# EAGLE schematic unoedge_v41 (EAGLE 7.3.0)
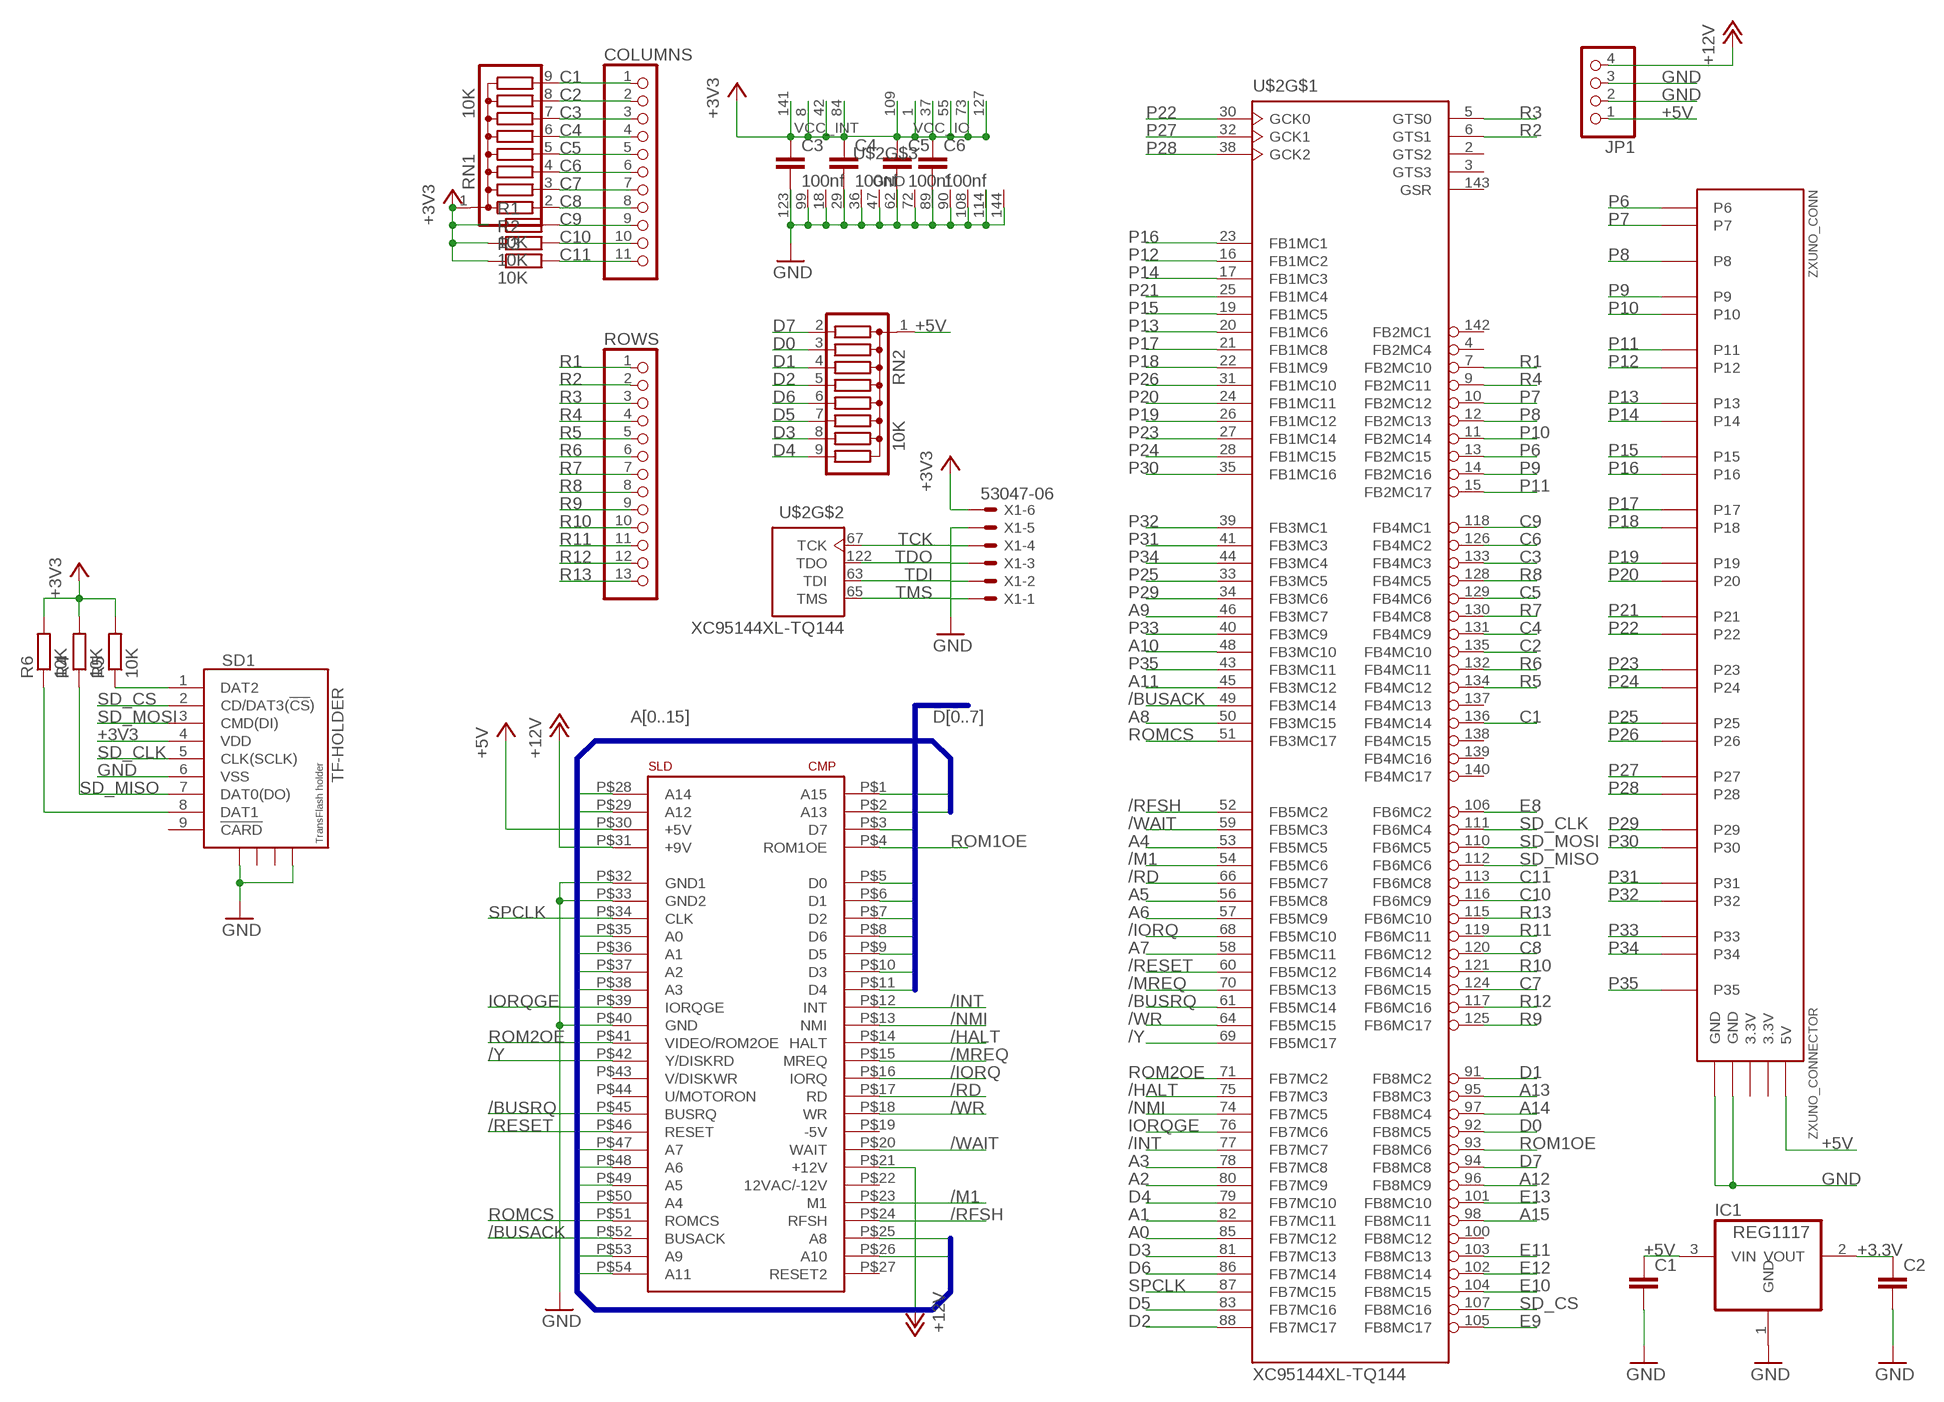
[diagram p0: schematic, sheet 1]

## Parts
C1  C-EUC0805  [C0805]
C2  C-EUC0805  [C0805]
C3  100nf  C-EUC0603  [C0603]
C4  100nf  C-EUC0603  [C0603]
C5  100nf  C-EUC0603  [C0603]
C6  100nf  C-EUC0603  [C0603]
COLUMNS  PINHD-1X11  [1X11]
IC1  REG1117  [SOT223]
JP1  PINHD-1X4  [1X04]
R1  10K  R-EU_R0603  [R0603]
R2  10K  R-EU_R0603  [R0603]
R3  10K  R-EU_R0603  [R0603]
R4  10K  R-EU_R0603  [R0603]
R5  10K  R-EU_R0603  [R0603]
R6  10K  R-EU_R0603  [R0603]
RN1  10K  G08R  [SIL9]
RN2  10K  G08R  [SIL9]
ROWS  PINHD-1X13  [1X13]
SD1  TF-HOLDER  [TF-PULL]
U$1  CONECTOR_EDGE_LADO_SPECTRUM  [CONECTOR_LADO_SPECTRUM]
U$2  XC95144XL-TQ144  [TQ144]
X1  53047-06  [53047-06]
ZXUNO_CONN  ZXUNO_CONNECTOR  [ZXUNO_CONNECTOR]

## Nets
+3.3V: C2.1 IC1.2(VOUT)
+3V3 [power]: C3.1 C4.1 C5.1 C6.1 R1.1 R2.1 R3.1 R4.2 R5.2 R6.2 RN1.1 SD1.4(VDD) U$2.1(VCC_IO) U$2.8(VCC_INT) U$2.37(VCC_IO) U$2.42(VCC_INT) U$2.55(VCC_IO) U$2.73(VCC_IO) U$2.84(VCC_INT) U$2.109(VCC_IO) U$2.127(VCC_IO) U$2.141(VCC_INT) X1.1
+5V [power]: C1.1 IC1.3(VIN) JP1.1 RN2.1 U$1.P$30(+5V) ZXUNO_CONN.5V
+12V [power]: JP1.4 U$1.P$21(+12V) U$1.P$31(+9V)
/BUSACK: U$1.P$52(BUSACK) U$2.49(FB3MC14)
/BUSRQ: U$1.P$45(BUSRQ) U$2.61(FB5MC14)
/HALT [power]: U$1.P$14(HALT) U$2.75(FB7MC3)
/INT: U$1.P$12(INT) U$2.77(FB7MC7)
/IORQ: U$1.P$16(IORQ) U$2.68(FB5MC10)
/M1: U$1.P$23(M1) U$2.54(FB5MC6)
/MREQ: U$1.P$15(MREQ) U$2.70(FB5MC13)
/NMI: U$1.P$13(NMI) U$2.74(FB7MC5)
/RD: U$1.P$17(RD) U$2.66(FB5MC7)
/RESET: U$1.P$46(RESET) U$2.60(FB5MC12)
/RFSH [power]: U$1.P$24(RFSH) U$2.52(FB5MC2)
/WAIT: U$1.P$20(WAIT) U$2.59(FB5MC3)
/WR: U$1.P$18(WR) U$2.64(FB5MC15)
/Y: U$1.P$42(Y/DISKRD) U$2.69(FB5MC17)
A0: U$1.P$35(A0) U$2.85(FB7MC12)
A1: U$1.P$36(A1) U$2.82(FB7MC11)
A2: U$1.P$37(A2) U$2.80(FB7MC9)
A3: U$1.P$38(A3) U$2.78(FB7MC8)
A4: U$1.P$50(A4) U$2.53(FB5MC5)
A5: U$1.P$49(A5) U$2.56(FB5MC8)
A6: U$1.P$48(A6) U$2.57(FB5MC9)
A7: U$1.P$47(A7) U$2.58(FB5MC11)
A8: U$1.P$25(A8) U$2.50(FB3MC15)
A9: U$1.P$53(A9) U$2.46(FB3MC7)
A10: U$1.P$26(A10) U$2.48(FB3MC10)
A11: U$1.P$54(A11) U$2.45(FB3MC12)
A12: U$1.P$29(A12) U$2.96(FB8MC9)
A13: U$1.P$2(A13) U$2.95(FB8MC3)
A14: U$1.P$28(A14) U$2.97(FB8MC4)
A15: U$1.P$1(A15) U$2.98(FB8MC11)
C1: COLUMNS.1 RN1.9 U$2.136(FB4MC14)
C2: COLUMNS.2 RN1.8 U$2.135(FB4MC10)
C3: COLUMNS.3 RN1.7 U$2.133(FB4MC3)
C4: COLUMNS.4 RN1.6 U$2.131(FB4MC9)
C5: COLUMNS.5 RN1.5 U$2.129(FB4MC6)
C6: COLUMNS.6 RN1.4 U$2.126(FB4MC2)
C7: COLUMNS.7 RN1.3 U$2.124(FB6MC15)
C8: COLUMNS.8 RN1.2 U$2.120(FB6MC12)
C9: COLUMNS.9 R1.2 U$2.118(FB4MC1)
C10: COLUMNS.10 R2.2 U$2.116(FB6MC9)
C11: COLUMNS.11 R3.2 U$2.113(FB6MC8)
D0: RN2.3 U$1.P$5(D0) U$2.92(FB8MC5)
D1: RN2.4 U$1.P$6(D1) U$2.91(FB8MC2)
D2: RN2.5 U$1.P$7(D2) U$2.88(FB7MC17)
D3: RN2.8 U$1.P$10(D3) U$2.81(FB7MC13)
D4: RN2.9 U$1.P$11(D4) U$2.79(FB7MC10)
D5: RN2.7 U$1.P$9(D5) U$2.83(FB7MC16)
D6: RN2.6 U$1.P$8(D6) U$2.86(FB7MC14)
D7: RN2.2 U$1.P$3(D7) U$2.94(FB8MC8)
E8: U$2.106(FB6MC2)
E9: U$2.105(FB8MC17)
E10: U$2.104(FB8MC15)
E11: U$2.103(FB8MC13)
E12: U$2.102(FB8MC14)
E13: U$2.101(FB8MC10)
GND [power]: C1.2 C2.2 C3.2 C4.2 C5.2 C6.2 IC1.1(GND) JP1.2 JP1.3 SD1.6(VSS) SD1.S1 SD1.S4 U$1.P$32(GND1) U$1.P$33(GND2) U$1.P$40(GND) U$2.18(GND) U$2.29(GND) U$2.36(GND) U$2.47(GND) U$2.62(GND) U$2.72(GND) U$2.89(GND) U$2.90(GND) U$2.99(GND) U$2.108(GND) U$2.114(GND) U$2.123(GND) U$2.144(GND) X1.2 ZXUNO_CONN.GND@1(GND) ZXUNO_CONN.GND@2(GND)
IORQGE: U$1.P$39(IORQGE) U$2.76(FB7MC6)
N$2: R6.1 SD1.8(DAT1)
N$3: R5.1 SD1.1(DAT2)
P6: U$2.13(FB2MC15) ZXUNO_CONN.P6
P7: U$2.10(FB2MC12) ZXUNO_CONN.P7
P8: U$2.12(FB2MC13) ZXUNO_CONN.P8
P9: U$2.14(FB2MC16) ZXUNO_CONN.P9
P10: U$2.11(FB2MC14) ZXUNO_CONN.P10
P11: U$2.15(FB2MC17) ZXUNO_CONN.P11
P12: U$2.16(FB1MC2) ZXUNO_CONN.P12
P13: U$2.20(FB1MC6) ZXUNO_CONN.P13
P14: U$2.17(FB1MC3) ZXUNO_CONN.P14
P15: U$2.19(FB1MC5) ZXUNO_CONN.P15
P16: U$2.23(FB1MC1) ZXUNO_CONN.P16
P17: U$2.21(FB1MC8) ZXUNO_CONN.P17
P18: U$2.22(FB1MC9) ZXUNO_CONN.P18
P19: U$2.26(FB1MC12) ZXUNO_CONN.P19
P20: U$2.24(FB1MC11) ZXUNO_CONN.P20
P21: U$2.25(FB1MC4) ZXUNO_CONN.P21
P22: U$2.30(GCK0) ZXUNO_CONN.P22
P23: U$2.27(FB1MC14) ZXUNO_CONN.P23
P24: U$2.28(FB1MC15) ZXUNO_CONN.P24
P25: U$2.33(FB3MC5) ZXUNO_CONN.P25
P26: U$2.31(FB1MC10) ZXUNO_CONN.P26
P27: U$2.32(GCK1) ZXUNO_CONN.P27
P28: U$2.38(GCK2) ZXUNO_CONN.P28
P29: U$2.34(FB3MC6) ZXUNO_CONN.P29
P30: U$2.35(FB1MC16) ZXUNO_CONN.P30
P31: U$2.41(FB3MC3) ZXUNO_CONN.P31
P32: U$2.39(FB3MC1) ZXUNO_CONN.P32
P33: U$2.40(FB3MC9) ZXUNO_CONN.P33
P34: U$2.44(FB3MC4) ZXUNO_CONN.P34
P35: U$2.43(FB3MC11) ZXUNO_CONN.P35
R1: ROWS.1 U$2.7(FB2MC10)
R2: ROWS.2 U$2.6(GTS1)
R3: ROWS.3 U$2.5(GTS0)
R4: ROWS.4 U$2.9(FB2MC11)
R5: ROWS.5 U$2.134(FB4MC12)
R6: ROWS.6 U$2.132(FB4MC11)
R7: ROWS.7 U$2.130(FB4MC8)
R8: ROWS.8 U$2.128(FB4MC5)
R9: ROWS.9 U$2.125(FB6MC17)
R10: ROWS.10 U$2.121(FB6MC14)
R11: ROWS.11 U$2.119(FB6MC11)
R12: ROWS.12 U$2.117(FB6MC16)
R13: ROWS.13 U$2.115(FB6MC10)
ROM1OE: U$1.P$4(ROM1OE) U$2.93(FB8MC6)
ROM2OE: U$1.P$41(VIDEO/ROM2OE) U$2.71(FB7MC2)
ROMCS: U$1.P$51(ROMCS) U$2.51(FB3MC17)
SD_CLK: SD1.5(CLK(SCLK)) U$2.111(FB6MC4)
SD_CS: SD1.2(CD/DAT3(!CS!)) U$2.107(FB8MC16)
SD_MISO: R4.1 SD1.7(DAT0(DO)) U$2.112(FB6MC6)
SD_MOSI: SD1.3(CMD(DI)) U$2.110(FB6MC5)
SPCLK: U$1.P$34(CLK) U$2.87(FB7MC15)
TCK: U$2.67(TCK) X1.3
TDI: U$2.63(TDI) X1.5
TDO: U$2.122(TDO) X1.4
TMS: U$2.65(TMS) X1.6
Unconnected: SD1.9(!CARD) SD1.S2 SD1.S3 U$1.P$19(-5V) U$1.P$22(12VAC/-12V) U$1.P$27(RESET2) U$1.P$43(V/DISKWR) U$1.P$44(U/MOTORON) U$2.2(GTS2) U$2.3(GTS3) U$2.4(FB2MC4) U$2.100(FB8MC12) U$2.137(FB4MC13) U$2.138(FB4MC15) U$2.139(FB4MC16) U$2.140(FB4MC17) U$2.142(FB2MC1) U$2.143(GSR)

## Buses
D[0..7]
A[0..15]

## Power pins joined to a net without a drawn wire
3.3V: ZXUNO_CONN.3.3V@1(3.3V) ZXUNO_CONN.3.3V@2(3.3V)

## Library data of the parts
C1-C6 = rcl:C-EU: CAPACITOR, European symbol
COLUMNS = pinhead:PINHD-1X11: PIN HEADER
IC1 = burr-brown:REG1117: 800mA and 1A Low Dropout (LDO) Positive Regulator 1.8V, 2.5V, 2.85V, 3.3V, 5V, and Adj; MPN: REG1117; OC_FARNELL: 1097566; OC_NEWARK: 14P6981
JP1 = pinhead:PINHD-1X4: PIN HEADER
R1-R6 = rcl:R-EU_: RESISTOR, European symbol
RN1 RN2 = resistor-sil:G08R: SIL RESISTOR; OC_FARNELL: unknown; OC_NEWARK: unknown
ROWS = pinhead:PINHD-1X13: PIN HEADER
SD1 = sd-mmc:TF-HOLDER: TF / Micro SD socket is PUSH-PUSH type, the card can be pushed into and auto locked and pushed out by simply press the card. Surface Mounting type.
U$1 = zx_spectrum:CONECTOR_EDGE_LADO_SPECTRUM
U$2 = XC9500XLneu:XC95144XL-TQ144
X1 = con-molex:53?-06: CONNECTOR wire to board 1.25 mm (.049 inch) pitch header; MPN: 53047-0610-C; OC_FARNELL: 9733078; OC_NEWARK: 03M2965
ZXUNO_CONN = zxuno:ZXUNO_CONNECTOR

## Net classes
0 default: width 0.178 mm, clearance 0.178 mm
1 power: width 0.305 mm, clearance 0.178 mm to class 0, clearance 0.229 mm